# EAGLE schematic supply (EAGLE 8.0.0)
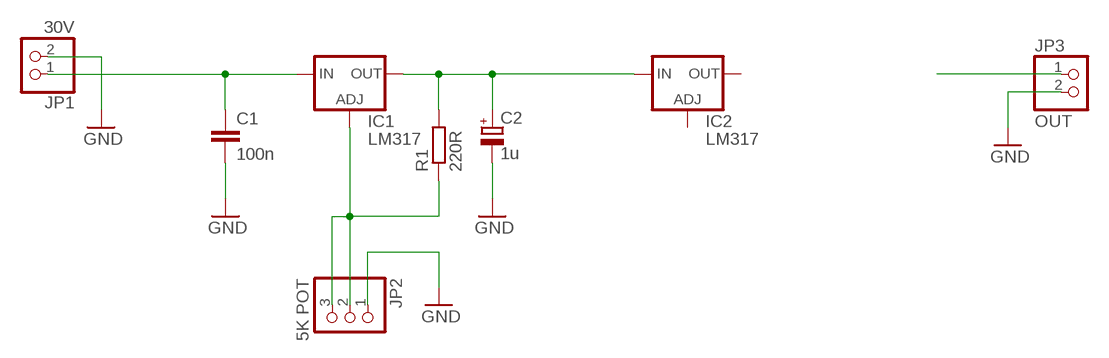
[diagram p0: schematic, sheet 1]

## Parts
C1  100n  C-EU050-024X044  [C050-024X044]
C2  1u  CPOL-EUE2-5  [E2-5]
IC1  LM317  LM317TS  [317TS]
IC2  LM317  LM317TS  [317TS]
JP1  30V  PINHD-1X2  [1X02]
JP2  5K POT  PINHD-1X3  [1X03]
JP3  OUT  PINHD-1X2  [1X02]
R1  220R  R-EU_0204/5  [0204/5]

## Nets
GND: C1.2 C2.- JP1.2 JP2.1 JP3.2
N$2: C1.1 IC1.3(IN) JP1.1
N$3: C2.+ IC1.2(OUT) IC2.3(IN) R1.2
N$4: IC1.1(ADJ) JP2.2 JP2.3 R1.1
N$10: JP3.1
Unconnected: IC2.1(ADJ) IC2.2(OUT)

## Library data of the parts
C1 = rcl:C-EU: CAPACITOR, European symbol
C2 = rcl:CPOL-EU: POLARIZED CAPACITOR, European symbol
IC1 IC2 = v-reg:LM317TS: VOLTAGE REGULATOR
JP1 JP3 = pinhead:PINHD-1X2: PIN HEADER
JP2 = pinhead:PINHD-1X3: PIN HEADER
R1 = rcl:R-EU_: RESISTOR, European symbol